# EAGLE schematic phase-90 (EAGLE 9.6.2)
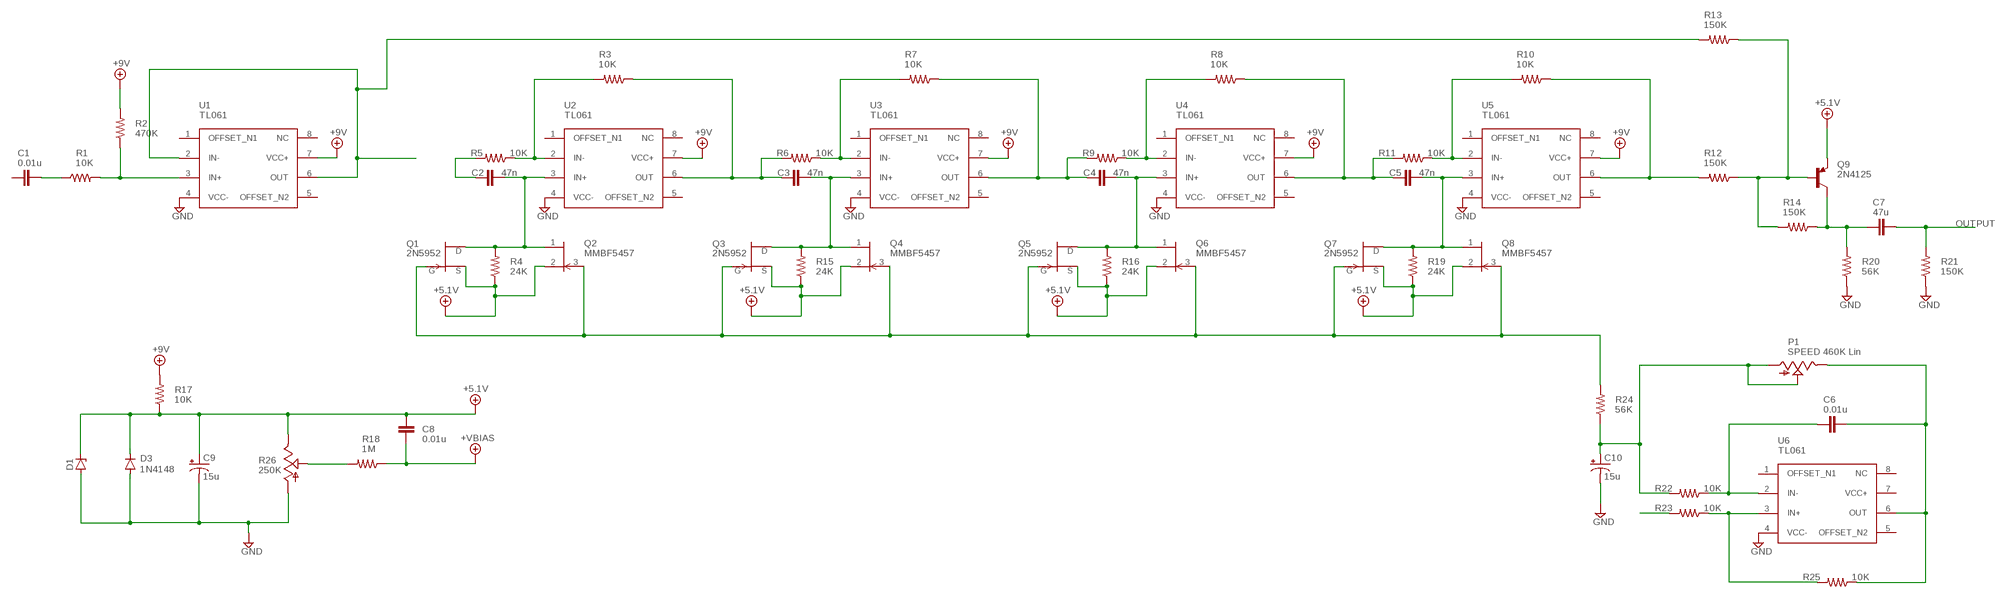
[diagram p0: schematic, sheet 1]

## Parts
C1  0.01u  C-EU050-024X044  [C050-024X044]
C2  47n  C-EU050-024X044  [C050-024X044]
C3  47n  C-EU050-024X044  [C050-024X044]
C4  47n  C-EU050-024X044  [C050-024X044]
C5  47n  C-EU050-024X044  [C050-024X044]
C6  0.01u  C-EU050-024X044  [C050-024X044]
C7  47u  C-EU050-024X044  [C050-024X044]
C8  0.01u  C-EU050-024X044  [C050-024X044]
C9  15u  CPOL-USE3.5-8  [E3,5-8]
C10  15u  CPOL-USE3.5-8  [E3,5-8]
D1  ZENER-DIODEDO34-7  [DO34Z7]
D3  1N4148  1N4148DO35-7  [DO35-7]
P1  SPEED 460K Lin  POT  [POT-5.08MM]
Q1  2N5952  2N5950  [TO-92]
Q2  MMBF5457  [SOT23]
Q3  2N5952  2N5950  [TO-92]
Q4  MMBF5457  [SOT23]
Q5  2N5952  2N5950  [TO-92]
Q6  MMBF5457  [SOT23]
Q7  2N5952  2N5950  [TO-92]
Q8  MMBF5457  [SOT23]
Q9  2N4125  -PNP-TO92  [TO92]
R1  10K  R-US_0309/12  [0309/12]
R2  470K  R-US_0309/12  [0309/12]
R3  10K  R-US_0309/12  [0309/12]
R4  24K  R-US_0309/12  [0309/12]
R5  10K  R-US_0309/12  [0309/12]
R6  10K  R-US_0309/12  [0309/12]
R7  10K  R-US_0309/12  [0309/12]
R8  10K  R-US_0309/12  [0309/12]
R9  10K  R-US_0309/12  [0309/12]
R10  10K  R-US_0309/12  [0309/12]
R11  10K  R-US_0309/12  [0309/12]
R12  150K  R-US_0309/12  [0309/12]
R13  150K  R-US_0309/12  [0309/12]
R14  150K  R-US_0309/12  [0309/12]
R15  24K  R-US_0309/12  [0309/12]
R16  24K  R-US_0309/12  [0309/12]
R17  10K  R-US_0309/12  [0309/12]
R18  1M  R-US_0309/12  [0309/12]
R19  24K  R-US_0309/12  [0309/12]
R20  56K  R-US_0309/12  [0309/12]
R21  150K  R-US_0309/12  [0309/12]
R22  10K  R-US_0309/12  [0309/12]
R23  10K  R-US_0309/12  [0309/12]
R24  56K  R-US_0309/12  [0309/12]
R25  10K  R-US_0309/12  [0309/12]
R26  250K  TRIM_US-CA6V  [CA6V]
U1  TL061  [DIL08]
U2  TL061  [DIL08]
U3  TL061  [DIL08]
U4  TL061  [DIL08]
U5  TL061  [DIL08]
U6  TL061  [DIL08]

## Nets
+5V/1: C8.2 C9.+ D1.C D3.C Q1.2(S) Q2.2(S) Q3.2(S) Q4.2(S) Q5.2(S) Q6.2(S) Q7.2(S) Q8.2(S) Q9.1(E) R4.1 R15.1 R16.1 R17.1 R19.1 R26.E ; supply symbol labelled +5.1V
+5V/2: C8.1 R18.1 ; supply symbol labelled +VBIAS
+9V: R2.2 R17.2 U1.7(VCC+) U2.7(VCC+) U3.7(VCC+) U4.7(VCC+) U5.7(VCC+)
GND: C9.- C10.- D1.A D3.A R20.1 R21.1 R26.A U1.4(VCC-) U2.4(VCC-) U3.4(VCC-) U4.4(VCC-) U5.4(VCC-) U6.4(VCC-)
N$1: C1.2 R1.1
N$2: R1.2 R2.1 U1.3(IN+)
N$3: C6.1 R22.1 U6.2(IN-)
N$4: R3.2 R5.1 U2.2(IN-)
N$5: R18.2 R26.S
N$6: C3.2 Q3.3(D) Q4.1(D) R15.2 U3.3(IN+)
N$8: R23.2
N$12: Q1.1(G) Q2.3(G) Q3.1(G) Q4.3(G) Q5.1(G) Q6.3(G) Q7.1(G) Q8.3(G) R24.2
N$13: Q9.2(B) R12.1 R13.1 R14.2
N$14: C2.2 Q1.3(D) Q2.1(D) R4.2 U2.3(IN+)
N$15: C7.1 Q9.3(C) R14.1 R20.2
N$17: C2.1 R5.2
N$18: R6.1 R7.2 U3.2(IN-)
N$20: R10.1 R12.2 U5.6(OUT)
N$21: R8.2 R9.1 U4.2(IN-)
N$22: C4.2 Q5.3(D) Q6.1(D) R16.2 U4.3(IN+)
N$23: C4.1 R7.1 R9.2 U3.6(OUT)
N$24: R10.2 R11.1 U5.2(IN-)
N$25: C5.2 Q7.3(D) Q8.1(D) R19.2 U5.3(IN+)
N$26: C5.1 R8.1 R11.2 U4.6(OUT)
N$27: C3.1 R3.1 R6.2 U2.6(OUT)
N$28: R13.2 U1.2(IN-) U1.6(OUT)
N$30: R23.1 R25.2 U6.3(IN+)
N$32: C6.2 P1.3 R25.1 U6.6(OUT)
N$33: C10.+ P1.1 P1.2 R22.2 R24.1
OUTPUT: C7.2 R21.2
Unconnected: C1.1 U1.1(OFFSET_N1) U1.5(OFFSET_N2) U1.8(NC) U2.1(OFFSET_N1) U2.5(OFFSET_N2) U2.8(NC) U3.1(OFFSET_N1) U3.5(OFFSET_N2) U3.8(NC) U4.1(OFFSET_N1) U4.5(OFFSET_N2) U4.8(NC) U5.1(OFFSET_N1) U5.5(OFFSET_N2) U5.8(NC) U6.1(OFFSET_N1) U6.5(OFFSET_N2) U6.7(VCC+) U6.8(NC)

## Library data of the parts
C1-C8 = rcl:C-EU: CAPACITOR, European symbol; SPICEPREFIX: C
C9 C10 = rcl:CPOL-US: POLARIZED CAPACITOR, American symbol; SPICEPREFIX: C
D1 = diode:ZENER-DIODE: Z-Diode
D3 = diode:1N4148: DIODE high speed (Philips)
P1 = guitar-pedals:POT
Q1 Q3 Q5 Q7 = transistor-fet:2N5950: N-Channel JFET RF Amplifier
Q2 Q4 Q6 Q8 = guitar-pedals:MMBF5457
Q9 = transistor:*-PNP-: PNP Transistror
R1-R25 = rcl:R-US_: RESISTOR, American symbol; SPICEPREFIX: R
R26 = pot:TRIM_US-: POTENTIOMETER
U1-U6 = guitar-pedals:TL061